# EAGLE design can (EAGLE 7.7.0)
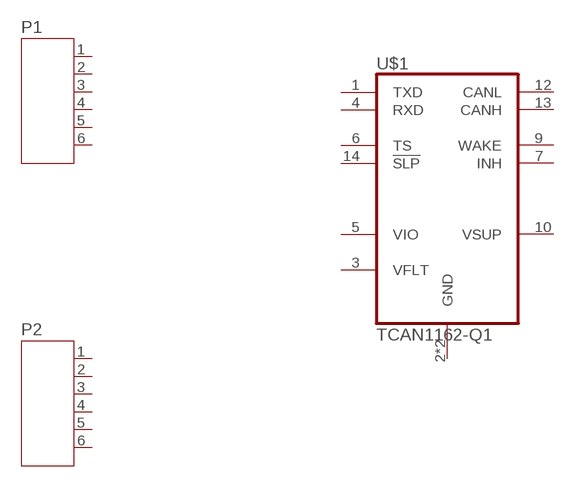
[diagram p0: schematic, sheet 1]

## Parts
P1  JST-PH6  [JST-PH6]
P2  JST-PH6  [JST-PH6]
U$1  TCAN1162-Q1  [VSON14]
Unconnected: P1.1 P1.2 P1.3 P1.4 P1.5 P1.6 P2.1 P2.2 P2.3 P2.4 P2.5 P2.6 U$1.1(TXD) U$1.4(RXD) U$1.6(TS) U$1.7(INH) U$1.9(WAKE) U$1.12(CANL) U$1.13(CANH) U$1.14(!SLP)

## Power pins joined to a net without a drawn wire
GND: U$1.2(GND) U$1.GP(GND)
VFLT: U$1.3(VFLT)
VIO: U$1.5(VIO)
VSUP: U$1.10(VSUP)

## Library data of the parts
P1 P2 = toyotune:JST-PH6
U$1 = toyotune:TCAN1162-Q1

## Board
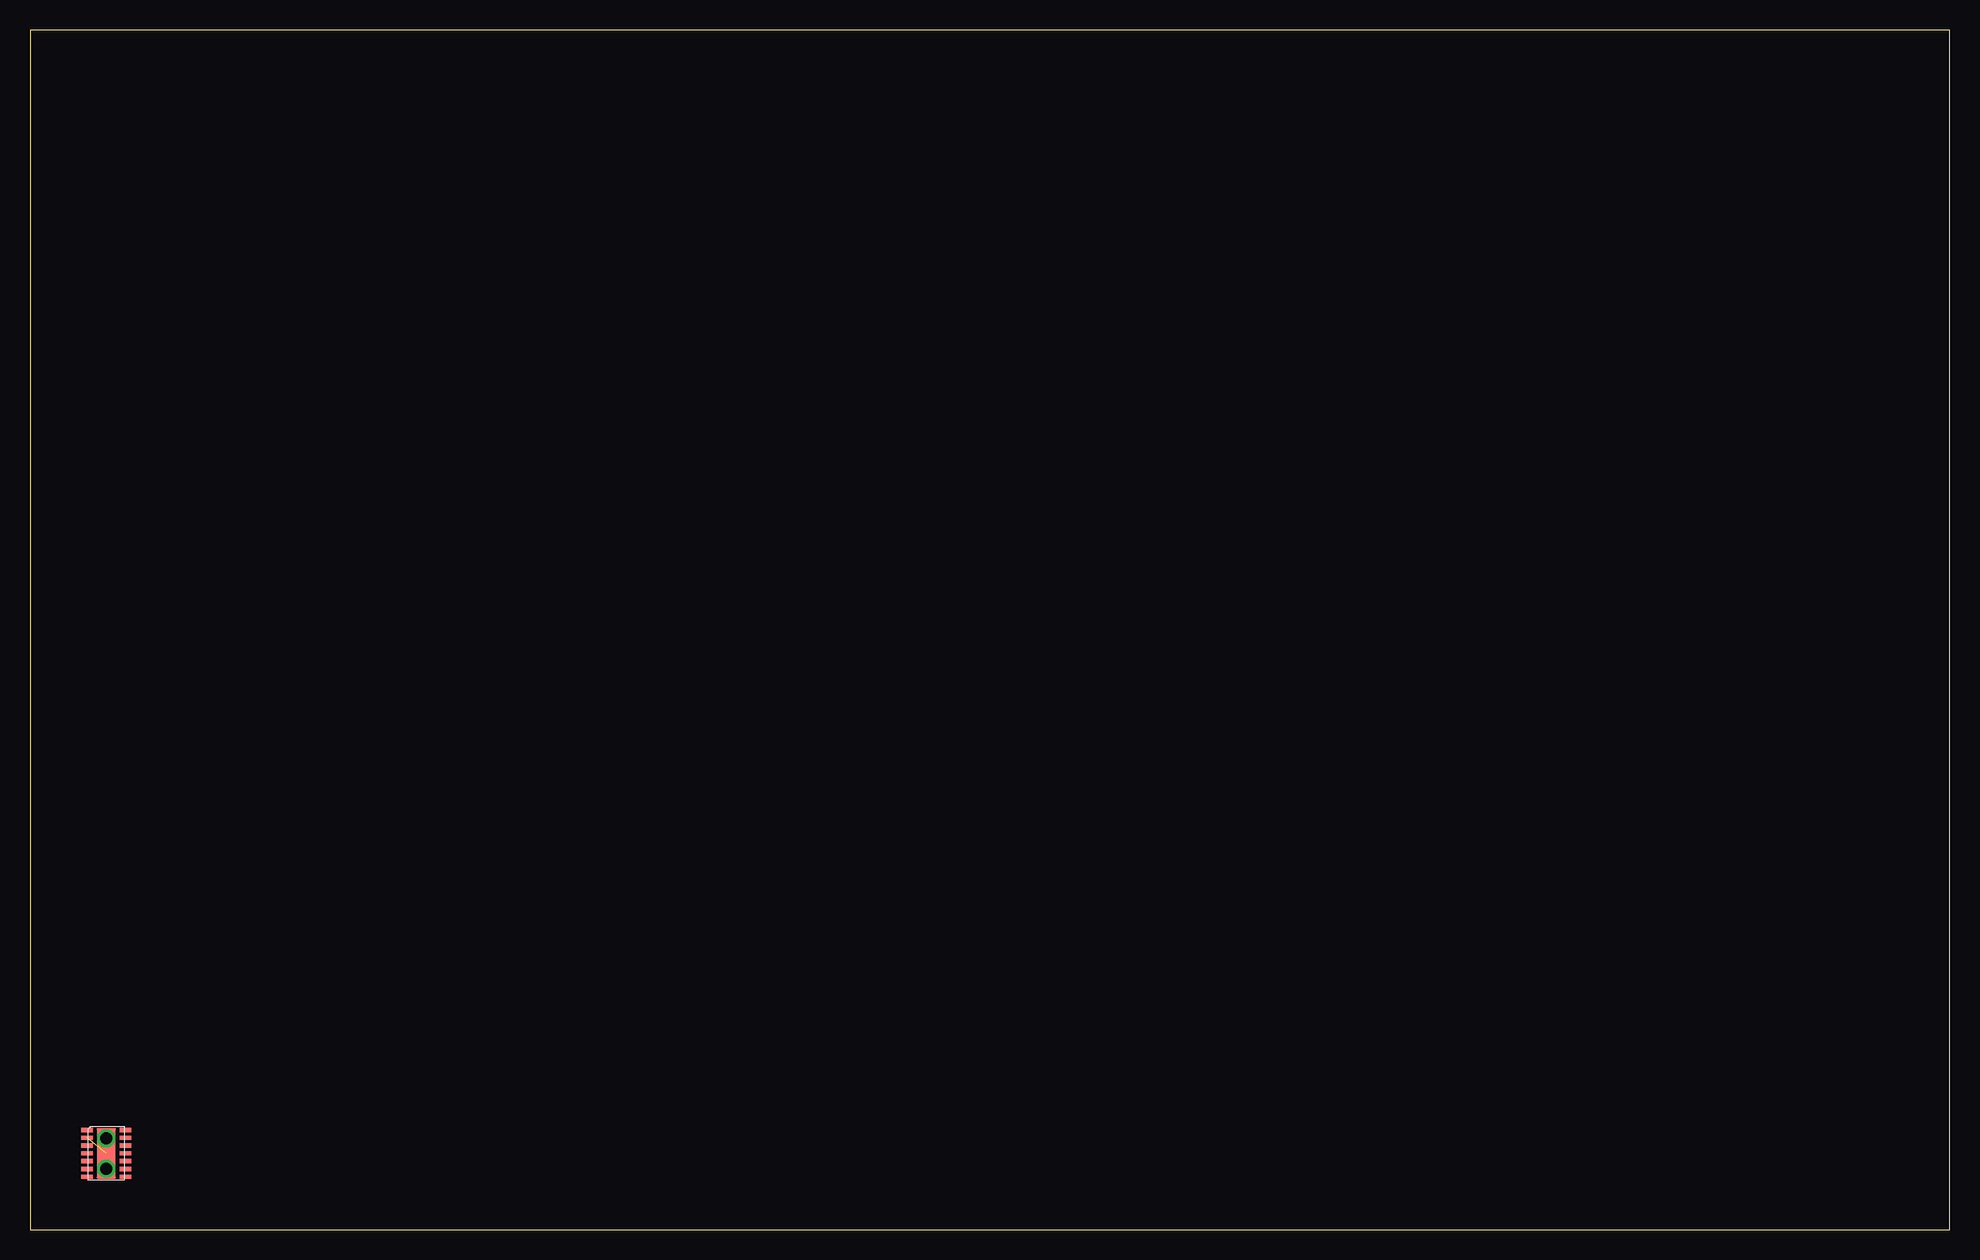
[diagram p1: board, top side]

Size 160 x 100 mm. Coordinates in mm from the lower left corner, seen from the top.
Outline: 0,0 160,0 160,100 0,100 0,0
Copper layers (1*16): Top 0.035mm / dielectric 1.5mm / Bottom 0.035mm
Design rules "default": minimum track width 10mil, minimum drill 24mil, track to track 8mil, track to pad 8mil, pad to pad 8mil, via to via 8mil, smd to smd 8mil, copper to edge 40mil, drill to drill 8mil, minimum pad ring 10mil, minimum via ring 8mil, stop-mask expansion 4mil, vias tented up to drill 0mil, thermal gap 10mil

### Footprints (pad centres in the part's own frame; a part is rotated, then mirrored left to right if it is on the bottom)
JST-PH6 = drill 0.813 pad 1.676: 1 5,0; 2 3,0; 3 1,0; 4 -1,0; 5 -3,0; 6 -5,0
VSON14 = smd 1 x 0.3: 1 -1.6,1.95; 2 -1.6,1.3; 3 -1.6,0.65; 4 -1.6,0; 5 -1.6,-0.65; 6 -1.6,-1.3; 7 -1.6,-1.95; 8 1.6,-1.95; 9 1.6,-1.3; 10 1.6,-0.65; 11 1.6,0; 12 1.6,0.65; 13 1.6,1.3; 14 1.6,1.95 | smd 1.6 x 4.2: GP 0,0

### Placement (x,y rotation side)
P1  13.97,-10.16 0 top  (outside the outline)
P2  13.97,-27.94 0 top  (outside the outline)
U$1  6.35,6.35 0 top

### Tracks (layer width: path | path; a pad name or v marks a point on that pad's centre or on a via)
GND  (1 unrouted)
N$1  (via drill 1 pad 0.25)
  other vias: 6.35,7.62
N$2  (via drill 1 pad 0.25)
  other vias: 6.35,5.08